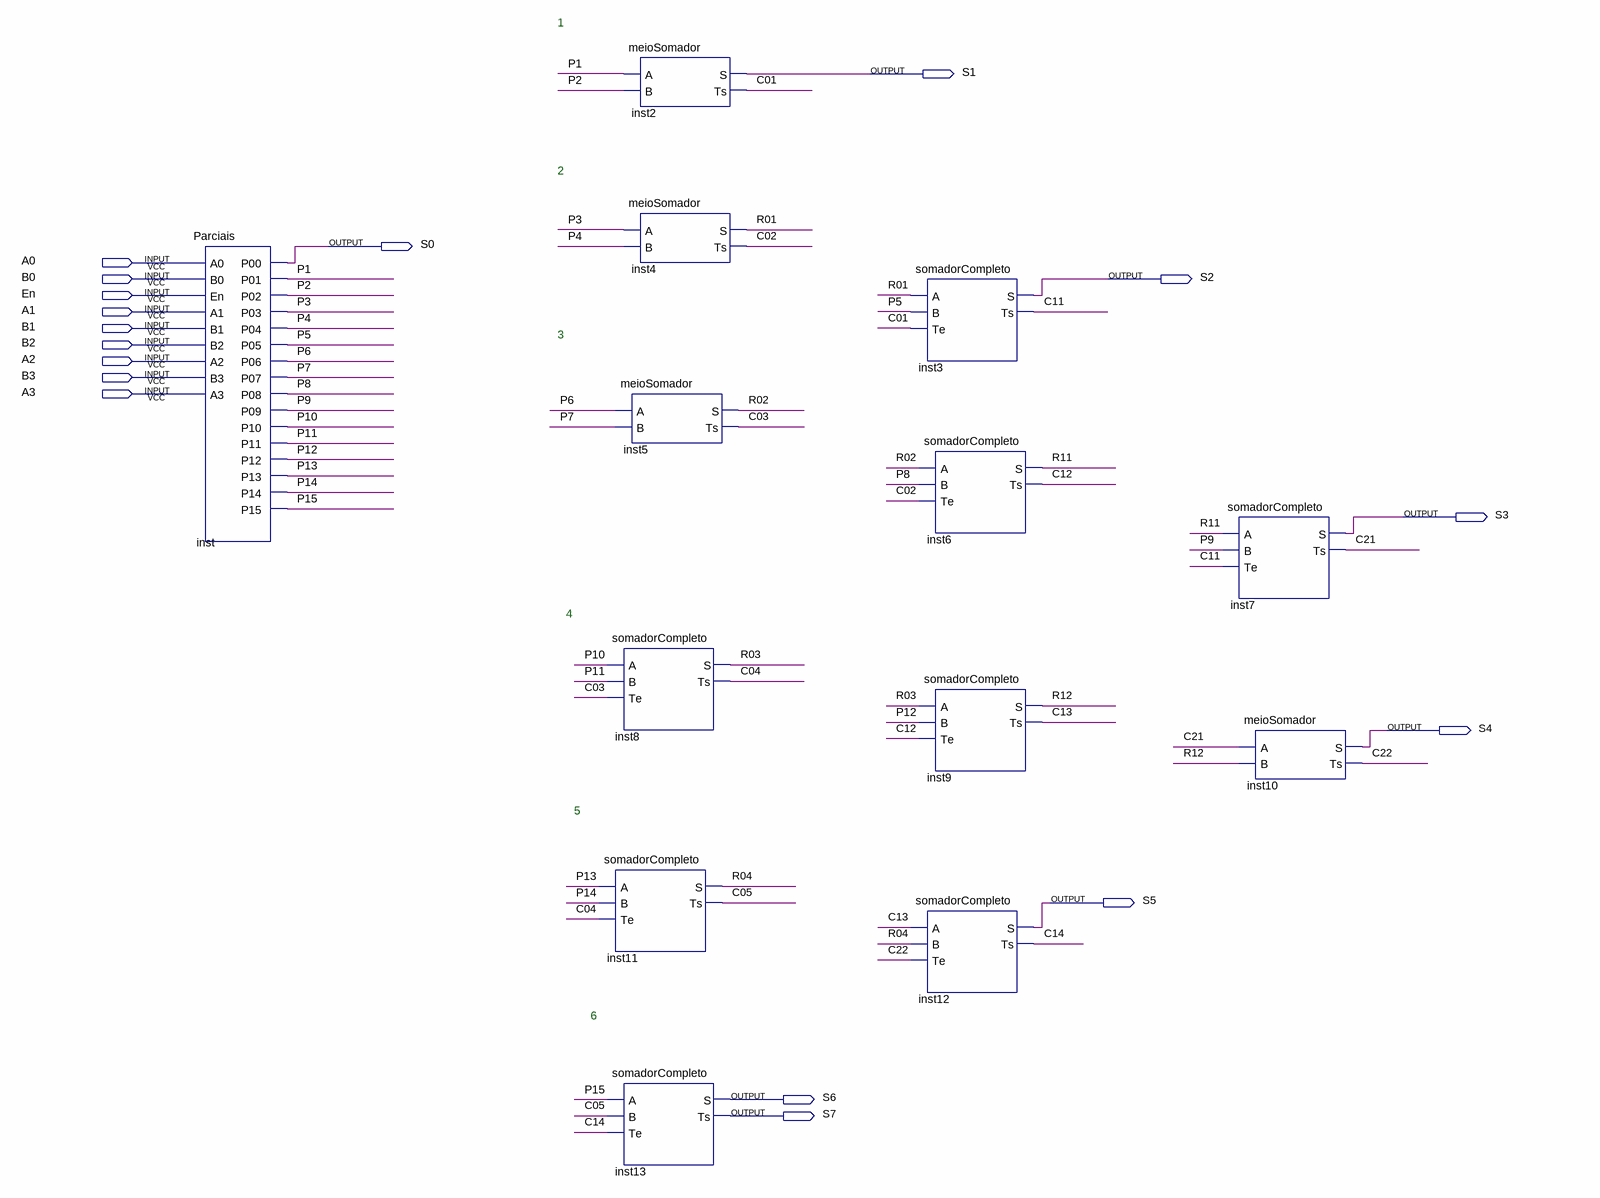
[diagram p0: schematic sheet]
// Quartus schematic Sistema.bdf as structural Verilog: 13 symbols, 17 pins
module Sistema (
  input  A0,
  input  B0,
  input  En,
  input  A1,
  input  B1,
  input  B2,
  input  A2,
  input  B3,
  input  A3,
  output S1,
  output S0,
  output S2,
  output S3,
  output S4,
  output S5,
  output S6,
  output S7
);

  wire C01, C02, C03, C04, C05, C11, C12, C13, C14, C21, C22, P1, P2, P3, P4, P5, P6, P7, P8, P9, P10, P11,
       P12, P13, P14, P15, R01, R02, R03, R04, R11, R12;

  Parciais inst (
    .A0(A0), .B0(B0), .En(En), .A1(A1), .B1(B1), .B2(B2), .A2(A2), .B3(B3), .A3(A3), .P00(S0), .P01(P1),
    .P02(P2), .P03(P3), .P04(P4), .P05(P5), .P06(P6), .P07(P7), .P08(P8), .P09(P9), .P10(P10), .P11(P11),
    .P12(P12), .P13(P13), .P14(P14), .P15(P15));
  somadorCompleto inst8 (.A(P10), .B(P11), .Te(C03), .S(R03), .Ts(C04));
  somadorCompleto inst11 (.A(P13), .B(P14), .Te(C04), .S(R04), .Ts(C05));
  somadorCompleto inst13 (.A(P15), .B(C05), .Te(C14), .S(S6), .Ts(S7));
  meioSomador inst2 (.A(P1), .B(P2), .S(S1), .Ts(C01));
  meioSomador inst4 (.A(P3), .B(P4), .S(R01), .Ts(C02));
  meioSomador inst5 (.A(P6), .B(P7), .S(R02), .Ts(C03));
  somadorCompleto inst3 (.A(R01), .B(P5), .Te(C01), .S(S2), .Ts(C11));
  somadorCompleto inst6 (.A(R02), .B(P8), .Te(C02), .S(R11), .Ts(C12));
  somadorCompleto inst9 (.A(R03), .B(P12), .Te(C12), .S(R12), .Ts(C13));
  somadorCompleto inst12 (.A(C13), .B(R04), .Te(C22), .S(S5), .Ts(C14));
  somadorCompleto inst7 (.A(R11), .B(P9), .Te(C11), .S(S3), .Ts(C21));
  meioSomador inst10 (.A(C21), .B(R12), .S(S4), .Ts(C22));

  // Notes on the sheet:
  //   1
  //   2
  //   3
  //   4
  //   5
  //   6
endmodule
